# Altium schematic sheet stm32.SchDoc
size A3; PageSetup: Record=PageOptions|CenterHorizontal=True|CenterVertical=True|PrintScale=0.73|XCorrection=1.00|YCorrection=1.00|PrintKind=0|BorderSize=5000000|LeftOffset=0|BottomOffset=0|Orientation=2|PaperLength=1000|PaperWidth=1000|Scale=100|PaperSource=7|PrintQuality=600|MediaType=1|DitherType=10|PaperKind=A4|PrintScaleMode=1
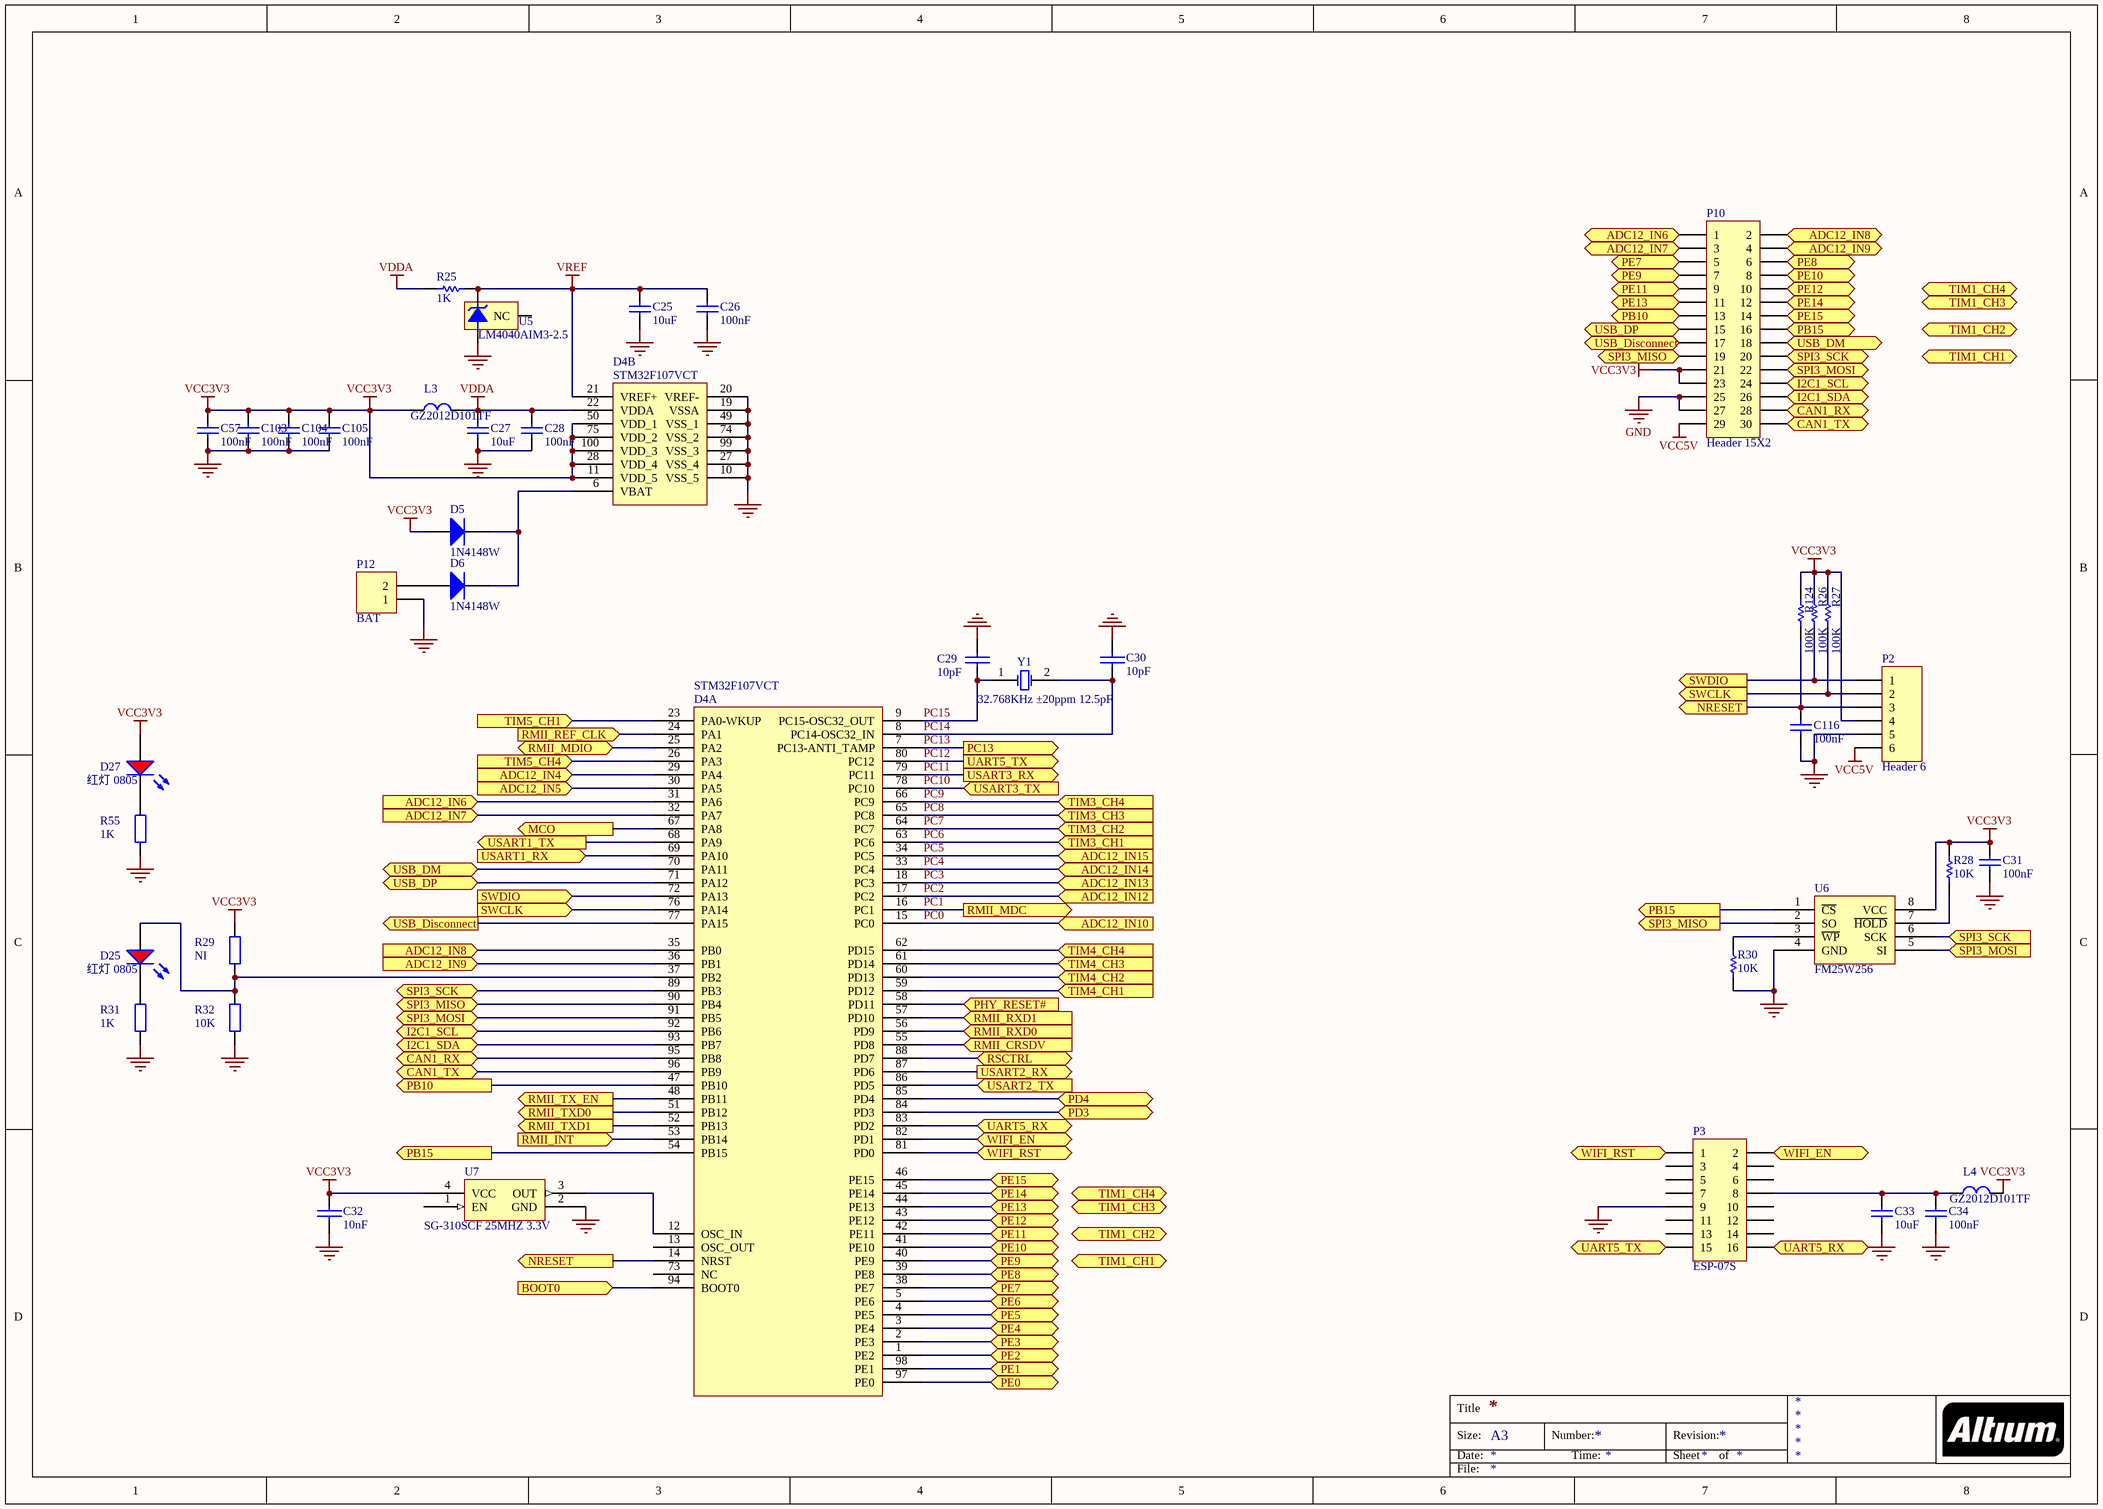
[diagram p0: stm32.SchDoc]

## Parts
C25  10uF  [0805_C]
C26  100nF  [0805_C]
C27  10uF  [0805_C]
C28  100nF  [0805_C]
C29  10pF  [0805_C]
C30  10pF  [0805_C]
C31  100nF  [0805_C]
C32  10nF  [0805_C]
C33  10uF  [0805_C]
C34  100nF  [0805_C]
C57  100nF  [0805_C]
C103  100nF  [0805_C]
C104  100nF  [0805_C]
C105  100nF  [0805_C]
C116  100nF  [0805_C]
D4  STM32F107VCT  [LQFP-100_14x14x05P]  (parts A,B of 2)
D5  1N4148W  [SOD-123]
D6  1N4148W  [SOD-123]
D25  红灯 0805  [0805_LED_S1]
D27  红灯 0805  [0805_LED_S1]
L3  GZ2012D101TF  [0805_L]
L4  GZ2012D101TF  [0805_L]
P2  Header 6  [TJC3-6A]
P3  ESP-07S  [ESP-07S]
P10  Header 15X2  [HDR2X15]
P12  BAT  [TJC3-2A]
R25  1K  [0805_R]
R26  100K  [0805_R]
R27  100K  [0805_R]
R28  10K  [0805_R]
R29  NI  [0805_R]
R30  10K  [0805_R]
R31  1K  [0805_R]
R32  10K  [0805_R]
R55  1K  [0805_R]
R124  100K  [0805_R]
U5  LM4040AIM3-2.5  [MF03A_N]
U6  FM25W256  [SO8]
U7  SG-310SCF 25MHZ 3.3V  [SMD-3225_4P]
Y1  32.768KHz ±20ppm 12.5pF  [SMD-3215_2P FC - 135]

## Ports
ADC12_IN4 (in), ADC12_IN5 (in), ADC12_IN6 (in), ADC12_IN7 (in), ADC12_IN8 (in), ADC12_IN9 (in), ADC12_IN10 (in), ADC12_IN12 (in), ADC12_IN13 (in), ADC12_IN14 (in), ADC12_IN15 (in), BOOT0 (in), CAN1_RX, CAN1_TX, I2C1_SCL, I2C1_SDA, MCO (out), NRESET (out), PB10 (out), PB15 (out), PC13 (out), PD3, PD4, PE0, PE1, PE2, PE3, PE4, PE5, PE6, PE7, PE8, PE9, PE10, PE11, PE12, PE13, PE14, PE15, PHY_RESET# (in), RMII_CRSDV (in), RMII_INT (in), RMII_MDC (out), RMII_MDIO (bidir), RMII_REF_CLK (in), RMII_RXD0 (in), RMII_RXD1 (in), RMII_TX_EN (out), RMII_TXD0 (out), RMII_TXD1 (out), RSCTRL, SPI3_MISO, SPI3_MISO (out), SPI3_MOSI, SPI3_MOSI (in), SPI3_SCK, SPI3_SCK (in), SWCLK (in), SWCLK (out), SWDIO (in), SWDIO (out), TIM1_CH1 (in), TIM1_CH2 (in), TIM1_CH3 (in), TIM1_CH4 (in), TIM3_CH1 (in), TIM3_CH2 (in), TIM3_CH3 (in), TIM3_CH4 (in), TIM4_CH1 (in), TIM4_CH2 (in), TIM4_CH3 (in), TIM4_CH4 (in), TIM5_CH1 (in), TIM5_CH4 (in), UART5_RX, UART5_TX (out), USART1_RX (in), USART1_TX (out), USART2_RX (out), USART2_TX (in), USART3_RX (out), USART3_TX (in), USB_Disconnect (out), USB_DM (bidir), USB_DP (bidir), WIFI_EN, WIFI_RST

## Nets
GND: C25.1 C26.2 C27.1 C28.2 C29.1 C30.2 C31.1 C32.1 C33.1 C34.2 C57.2 C103.1 C104.1 C105.1 C116.1 D4.10(VSS_5) D4.19(VSSA) D4.20(VREF-) D4.27(VSS_4) D4.49(VSS_1) D4.74(VSS_2) D4.99(VSS_3) P2.5 P3.9 P10.25 P10.27 P12.1 R30.2 R31.2 R32.2 R55.2 U5.2(-V) U6.4(GND) U7.2(GND)
VCC3V3: C31.2 C32.2 C57.1 C103.2 C104.2 C105.2 D4.11(VDD_5) D4.28(VDD_4) D4.50(VDD_1) D4.75(VDD_2) D4.100(VDD_3) D5.1(A) D27.A L3.1 L4.2 P2.4 P10.21 P10.23 R26.2 R27.2 R28.2 R29.1 R124.2 U6.8(VCC) U7.4(VCC)
VCC5V: P2.6 P10.29
VDDA: C27.2 C28.1 D4.22(VDDA) L3.2 R25.1
VREF: C25.2 C26.1 D4.21(VREF+) R25.2 U5.1(+V)
ADC12_IN4: D4.29(PA4) ; port ADC12_IN4
ADC12_IN5: D4.30(PA5) ; port ADC12_IN5
ADC12_IN6: D4.31(PA6) P10.1 ; port ADC12_IN6
ADC12_IN7: D4.32(PA7) P10.3 ; port ADC12_IN7
ADC12_IN8: D4.35(PB0) P10.2 ; port ADC12_IN8
ADC12_IN9: D4.36(PB1) P10.4 ; port ADC12_IN9
BOOT0: D4.94(BOOT0) ; port BOOT0
CAN1_RX: D4.95(PB8) P10.28 ; port CAN1_RX
CAN1_TX: D4.96(PB9) P10.30 ; port CAN1_TX
I2C1_SCL: D4.92(PB6) P10.24 ; port I2C1_SCL
I2C1_SDA: D4.93(PB7) P10.26 ; port I2C1_SDA
MCO: D4.67(PA8) ; port MCO
NRESET: C116.2 D4.14(NRST) P2.3 R124.1 ; port NRESET
PB10: D4.47(PB10) P10.13 ; port PB10
PB15: D4.54(PB15) P10.16 U6.1(~{CS}) ; port PB15
PC0: D4.15(PC0) ; port ADC12_IN10
PC1: D4.16(PC1) ; port RMII_MDC
PC2: D4.17(PC2) ; port ADC12_IN12
PC3: D4.18(PC3) ; port ADC12_IN13
PC4: D4.33(PC4) ; port ADC12_IN14
PC5: D4.34(PC5) ; port ADC12_IN15
PC6: D4.63(PC6) ; port TIM3_CH1
PC7: D4.64(PC7) ; port TIM3_CH2
PC8: D4.65(PC8) ; port TIM3_CH3
PC9: D4.66(PC9) ; port TIM3_CH4
PC10: D4.78(PC10) ; port USART3_TX
PC11: D4.79(PC11) ; port USART3_RX
PC12: D4.80(PC12) P3.15 ; port UART5_TX
PC13: D4.7(PC13-ANTI_TAMP) ; port PC13
PC14: C30.1 D4.8(PC14-OSC32_IN) Y1.2(OSC2)
PC15: C29.2 D4.9(PC15-OSC32_OUT) Y1.1(OSC1)
PD3: D4.84(PD3) ; port PD3
PD4: D4.85(PD4) ; port PD4
PE0: D4.97(PE0) ; port PE0
PE1: D4.98(PE1) ; port PE1
PE2: D4.1(PE2) ; port PE2
PE3: D4.2(PE3) ; port PE3
PE4: D4.3(PE4) ; port PE4
PE5: D4.4(PE5) ; port PE5
PE6: D4.5(PE6) ; port PE6
PE7: D4.38(PE7) P10.5 ; port PE7
PE8: D4.39(PE8) P10.6 ; port PE8
PE9: D4.40(PE9) P10.7 ; port PE9
PE10: D4.41(PE10) P10.8 ; port PE10
PE11: D4.42(PE11) P10.9 ; port PE11
PE12: D4.43(PE12) P10.10 ; port PE12
PE13: D4.44(PE13) P10.11 ; port PE13
PE14: D4.45(PE14) P10.12 ; port PE14
PE15: D4.46(PE15) P10.14 ; port PE15
PHY_RESET#: D4.58(PD11) ; port PHY_RESET#
RMII_CRSDV: D4.55(PD8) ; port RMII_CRSDV
RMII_INT: D4.53(PB14) ; port RMII_INT
RMII_MDIO: D4.25(PA2) ; port RMII_MDIO
RMII_REF_CLK: D4.24(PA1) ; port RMII_REF_CLK
RMII_RXD0: D4.56(PD9) ; port RMII_RXD0
RMII_RXD1: D4.57(PD10) ; port RMII_RXD1
RMII_TX_EN: D4.48(PB11) ; port RMII_TX_EN
RMII_TXD0: D4.51(PB12) ; port RMII_TXD0
RMII_TXD1: D4.52(PB13) ; port RMII_TXD1
RSCTRL: D4.88(PD7) ; port RSCTRL
SPI3_MISO: D4.90(PB4) P10.19 U6.2(SO) ; port SPI3_MISO
SPI3_MOSI: D4.91(PB5) P10.22 U6.5(SI) ; port SPI3_MOSI
SPI3_SCK: D4.89(PB3) P10.20 U6.6(SCK) ; port SPI3_SCK
SWCLK: D4.76(PA14) P2.2 R27.1 ; port SWCLK
SWDIO: D4.72(PA13) P2.1 R26.1 ; port SWDIO
TIM4_CH1: D4.59(PD12) ; port TIM4_CH1
TIM4_CH2: D4.60(PD13) ; port TIM4_CH2
TIM4_CH3: D4.61(PD14) ; port TIM4_CH3
TIM4_CH4: D4.62(PD15) ; port TIM4_CH4
TIM5_CH1: D4.23(PA0-WKUP) ; port TIM5_CH1
TIM5_CH4: D4.26(PA3) ; port TIM5_CH4
UART5_RX: D4.83(PD2) P3.16 ; port UART5_RX
USART1_RX: D4.69(PA10) ; port USART1_RX
USART1_TX: D4.68(PA9) ; port USART1_TX
USART2_RX: D4.87(PD6) ; port USART2_RX
USART2_TX: D4.86(PD5) ; port USART2_TX
USB_Disconnect: D4.77(PA15) P10.17 ; port USB_Disconnect
USB_DM: D4.70(PA11) P10.18 ; port USB_DM
USB_DP: D4.71(PA12) P10.15 ; port USB_DP
WIFI_EN: D4.82(PD1) P3.2 ; port WIFI_EN
WIFI_RST: D4.81(PD0) P3.1 ; port WIFI_RST
NetC33_2: C33.2 C34.1 L4.1 P3.8
NetD4_6: D4.6(VBAT) D5.2(K) D6.2(K)
NetD4_12: D4.12(OSC_IN) U7.3(OUT)
NetD4_37: D4.37(PB2) D25.A R29.2 R32.1
NetD6_1: D6.1(A) P12.2
NetD25_K: D25.K R31.1
NetD27_K: D27.K R55.1
NetR28_1: R28.1 U6.7(~{HOLD})
NetR30_1: R30.1 U6.3(~{WP})

Not connected (* = marked no-connect by the designer): D4 13(OSC_OUT) 73(NC); P3 3 4 5 6 7 10 11 12 13 14; U5 3(NC); U7 1(EN)

## Notes on the sheet
- Title
- Size:
- Date:
- A3
- Number:
- Time:
- Revision:
- Sheet
- of
- File:

## Library data of the parts
C25 C27 C33 = 0805 10uF (106) 10% 25V: 贴片电容; ComponentLink1Description: 供应商链接; ComponentLink1URL: http://www.szlcsc.com/product/details_16532.html; Package: 0805; Supplier: LC; SuppliersPartNumber: C15850
C26 C28 C31 C34 C57 C103-C105 C116 = 0805 100nF(104) 10% 50V: 贴片电容; ComponentLink1Description: 供应商链接; ComponentLink1URL: http://www.szlcsc.com/product/details_50686.html; Package: 0805; Supplier: LC; SuppliersPartNumber: C49678
C29 C30 = CAP: Capacitor
C32 = G-CC41-0805-CG-50V-300J: 多层瓷介电容; 厂家: 元六; 质量保证等级: G; 质量等级: A2; 技术规范: Q/QYL20024-; 是否在目录内: 1N 2Y; 供货周期: 28; VALUE: G-CC41-0805-CG-50V-300J
D4 = BARRACUDA_256K: VALUE: MCU电路STM32F107VCT6; 厂家: ST
D5 D6 = Diode: Default Diode; Published: 8-Jun-2000; LatestRevisionDate: 17-Jul-2002; LatestRevisionNote: Re-released for DXP Platform.; PackageVersion: Sep-1996; PackageReference: SMC; Publisher: Altium Limited; Code_JEDEC: DO-214-AB
D25 D27 = 0805 红灯: 发光二极管; ComponentLink1Description: 供应商链接; ComponentLink1URL: http://www.szlcsc.com/product/details_2668.html; Package: 0805; Supplier: LC; SuppliersPartNumber: C2295
L3 L4 = L1: VALUE: 磁珠742792031; 厂家: 伍尔特
P2 = Header 6: Header, 6-Pin; LatestRevisionDate: 17-Jul-2002; LatestRevisionNote: Re-released for DXP Platform.; Publisher: Altium Limited
P3 = Header 8X2: Header, 8-Pin, Dual row; LatestRevisionDate: 17-Jul-2002; LatestRevisionNote: Re-released for DXP Platform.; Publisher: Altium Limited
P10 = Header 15X2: Header, 15-Pin, Dual row; LatestRevisionDate: 17-Jul-2002; LatestRevisionNote: Re-released for DXP Platform.; Publisher: Altium Limited
P12 = Header 2: Header, 2-Pin; LatestRevisionDate: 17-Jul-2002; LatestRevisionNote: Re-released for DXP Platform.; Publisher: Altium Limited
R25 = res1: Resistor; Published: 8-Jun-2000; Revision: July-2002: Re-released for DXP Platform.; Publisher: Altium Limited; Value: 1K
R26-R28 R124 = Res1: Resistor; Value: 1K; Published: 8-Jun-2000; LatestRevisionDate: 17-Jul-2002; LatestRevisionNote: Re-released for DXP Platform.; PackageReference: AXIAL-0.3; Publisher: Altium Limited
R29 = RMK2012KBxxx（10～1M）F: 贴片电阻; 质量保证等级: GJB; 技术规范: GJB1432A-99; 厂家: 718厂; VALUE: RMK2012KBxxxF
R30 = res1: Resistor; Value: 1K; Published: 8-Jun-2000; Revision: July-2002: Re-released for DXP Platform.; Publisher: Altium Limited
R31 R55 = RMK2012KBxxx（10～1M）F: 贴片电阻; 质量保证等级: GJB; 技术规范: GJB1432A-99; 厂家: 718厂; VALUE: RMK2012KB102F
R32 = RMK2012KBxxx（10～1M）F: 贴片电阻; 质量保证等级: GJB; 技术规范: GJB1432A-99; 厂家: 718厂; VALUE: RMK2012KB103F
U5 = LM4040AIM3-2.5: Precision Micropower Shunt Voltage Reference, 3-pin SOT-23; Manufacturer: National Semiconductor; PackageTopMarking: R2A*XTT; PowerWise: N; CompType: Voltage Reference IC; High-Reliability: Y; DatasheetVersion: Apr-2005; PackageVersion: revB, Mar-2003; PackageReference: MF03A; PackageDescription: Molded SOT-23, .115 x .051 x .037in Body, 3 Lead, .075 in Pitch; PartNumber: LM4040AIM3-2.5; RoHS: N; PinCount: 3; ComponentLink1Description: Manufacturer URL; ComponentLink1URL: http://www.national.com/; ComponentLink2Description: LM4040 Datasheet; ComponentLink2URL: http://www.national.com/ds/LM/LM4040.pdf; ComponentLink3Description: LM4040 Web Page; ComponentLink3URL: http://www.national.com/pf/LM/LM4040.html; ComponentLink4Description: MF03A Package Page; ComponentLink4URL: http://www.national.com/packaging/folders/mf03a.html
U6 = SPI_FLASH
U7 = SM7745HEV-50.0M
Y1 = SMD-3215_2P 32.768KHz 20ppm 12.5pF: 贴片晶振; ComponentLink1Description: 供应商链接; ComponentLink1URL: http://www.szlcsc.com/product/details_33310.html; Package: SMD-3215_2P; Supplier: LC; SuppliersPartNumber: C32346